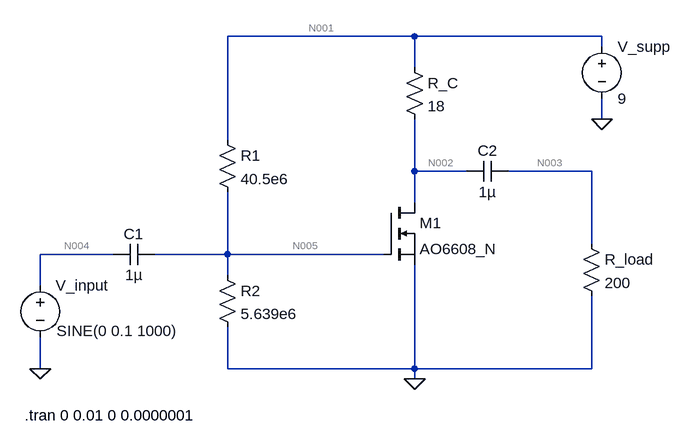
[diagram p0: schematic Draft3.asc]
Draft3.asc, the LTspice schematic file:
Version 4
SHEET 1 1120 680
WIRE 720 -320 432 -320
WIRE 1008 -320 720 -320
WIRE 1008 -304 1008 -320
WIRE 720 -272 720 -320
WIRE 1008 -192 1008 -224
WIRE 432 -160 432 -320
WIRE 720 -112 720 -192
WIRE 800 -112 720 -112
WIRE 992 -112 864 -112
WIRE 720 -64 720 -112
WIRE 992 0 992 -112
WIRE 256 16 144 16
WIRE 432 16 432 -80
WIRE 432 16 320 16
WIRE 672 16 432 16
WIRE 432 48 432 16
WIRE 144 64 144 16
WIRE 144 192 144 144
WIRE 432 192 432 128
WIRE 720 192 720 32
WIRE 720 192 432 192
WIRE 992 192 992 80
WIRE 992 192 720 192
WIRE 720 208 720 192
FLAG 144 192 0
FLAG 1008 -192 0
FLAG 720 208 0
SYMBOL voltage 144 48 R0
WINDOW 123 0 0 Left 0
WINDOW 39 0 0 Left 0
WINDOW 3 25 86 Left 2
SYMATTR InstName V_input
SYMATTR Value SINE(0 0.1 1000)
SYMBOL cap 320 0 R90
WINDOW 0 0 32 VBottom 2
WINDOW 3 32 32 VTop 2
SYMATTR InstName C1
SYMATTR Value 1µ
SYMBOL res 416 -176 R0
SYMATTR InstName R1
SYMATTR Value 40.5e6
SYMBOL res 416 32 R0
SYMATTR InstName R2
SYMATTR Value 5.639e6
SYMBOL res 704 -288 R0
SYMATTR InstName R_C
SYMATTR Value 18
SYMBOL voltage 1008 -320 R0
WINDOW 123 0 0 Left 0
WINDOW 39 0 0 Left 0
SYMATTR InstName V_supp
SYMATTR Value 9
SYMBOL cap 800 -128 M90
WINDOW 0 0 32 VBottom 2
WINDOW 3 32 32 VTop 2
SYMATTR InstName C2
SYMATTR Value 1µ
SYMBOL nmos 672 -64 R0
SYMATTR InstName M1
SYMATTR Value AO6608_N
SYMBOL res 976 -16 R0
SYMATTR InstName R_load
SYMATTR Value 200
TEXT 120 264 Left 2 !.tran 0 0.01 0 0.0000001

The netlist it stands for:
* Draft3.asc
V_input N004 0 SINE(0 0.1 1000)
C1 N005 N004 1µ
R1 N001 N005 40.5e6
R2 N005 0 5.639e6
R_C N001 N002 18
V_supp N001 0 9
C2 N002 N003 1µ
M1 N002 N005 0 0 AO6608_N
R_load N003 0 200
.model NMOS NMOS
.model PMOS PMOS
.lib standard.mos
.tran 0 0.01 0 0.0000001
.backanno
.end

* Results of the author's LTspice run, read from the files saved beside the schematic
* Operating Point, zero values left out:
*   V(n005) = 1.1 V
*   V(n001) = 9 V
*   V(n002) = 5.108 V
*   Id(M1) = 216.2 mA
*   Is(M1) = -216.2 mA
*   I(R1) = 195.1 nA
*   I(R2) = 195.1 nA
*   I(R_c) = 216.2 mA
*   I(V_supp) = -216.2 mA
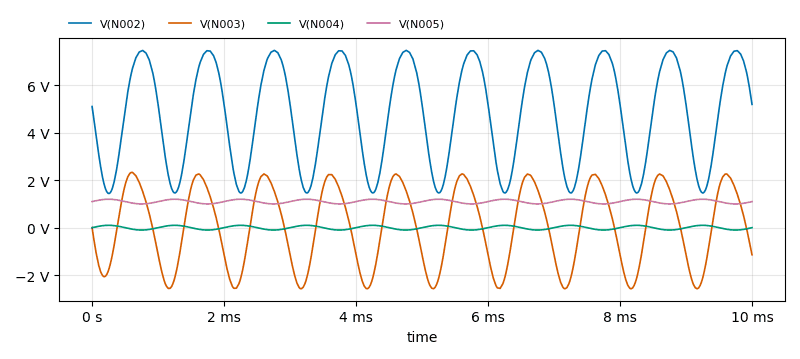
[diagram p1: Transient Analysis of Draft3.asc, plotted from the saved traces]
* Transient Analysis, 1 run:
*   V(N002): min 1.44 V, max 7.476 V, average 4.768 V, rms 5.232 V, last 5.199 V
*   V(N003): min -2.577 V, max 2.329 V, average 22.82 mV, rms 1.672 V, last -1.142 V
*   V(N004): min -99.97 mV, max 100 mV, average 160.2 µV, rms 70.59 mV, last 0 V
*   V(N005): min 1 V, max 1.2 V, average 1.1 V, rms 1.102 V, last 1.1 V